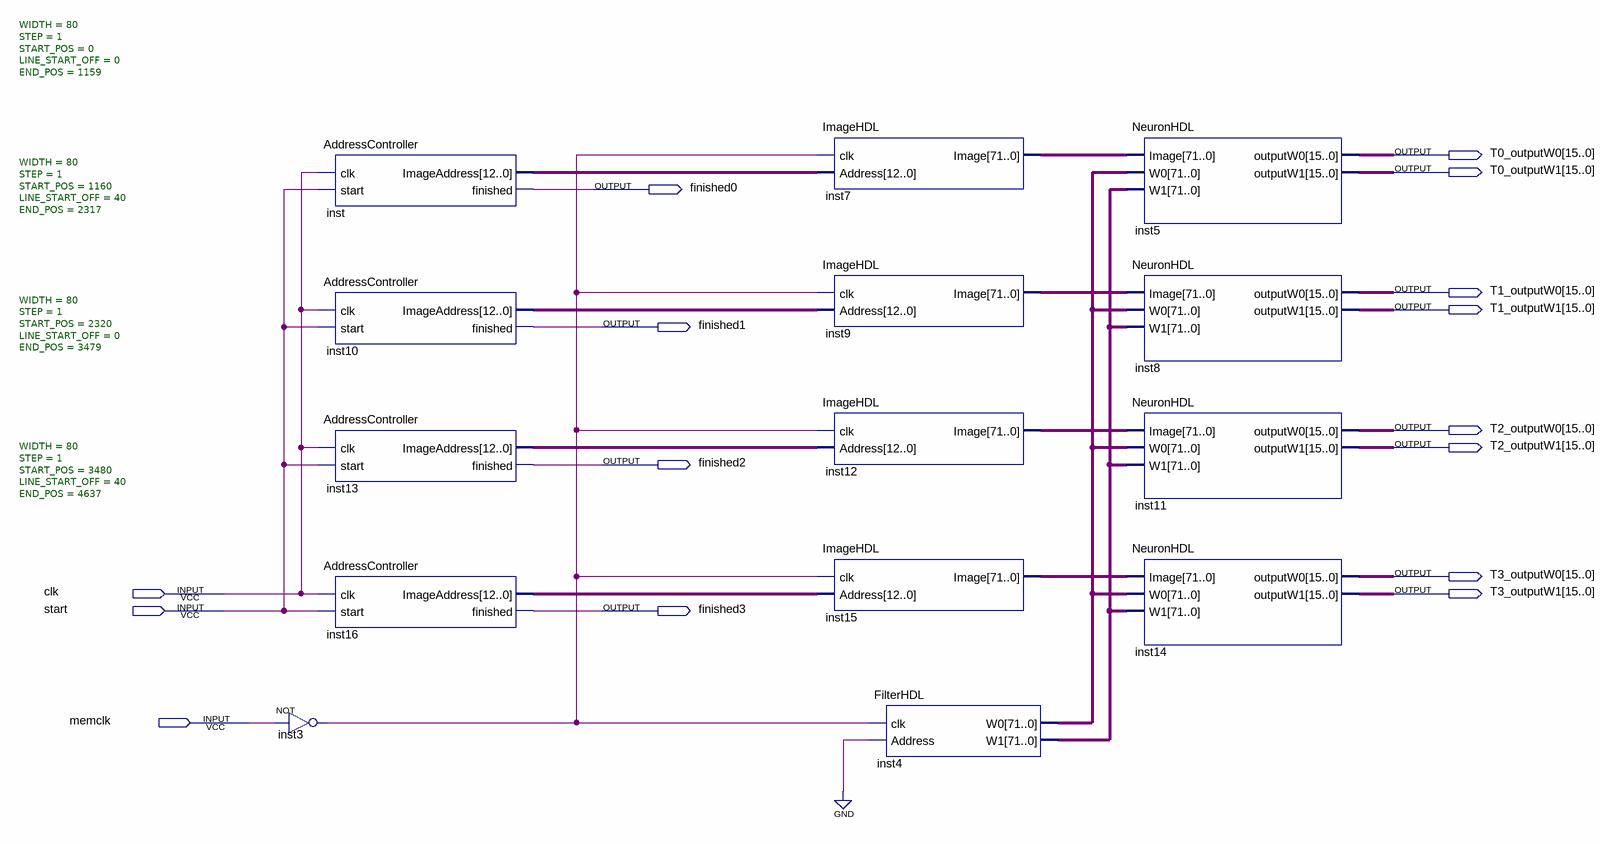
[diagram p0: schematic sheet]
// Quartus schematic CNN_LayerHDL.bdf as structural Verilog: 14 symbols, 15 pins
module CNN_LayerHDL (
  input  clk,
  input  start,
  input  memclk,
  output [15:0] T0_outputW0,
  output [15:0] T0_outputW1,
  output finished0,
  output [15:0] T1_outputW0,
  output [15:0] T1_outputW1,
  output finished1,
  output [15:0] T2_outputW0,
  output [15:0] T2_outputW1,
  output finished2,
  output [15:0] T3_outputW0,
  output [15:0] T3_outputW1,
  output finished3
);

  wire inst3_out;
  wire [12:0] inst10_imageaddress, inst13_imageaddress, inst16_imageaddress, inst_imageaddress;
  wire [71:0] inst4_w0, inst4_w1, inst7_image, inst9_image, inst12_image, inst15_image;

  AddressController #(.WIDTH(80), .STEP(1), .START_POS(0), .LINE_START_OFF(0), .END_POS(1159)) inst (
    .clk(clk), .start(start), .ImageAddress(inst_imageaddress), .finished(finished0));
  AddressController #(.WIDTH(80), .STEP(1), .START_POS(1160), .LINE_START_OFF(40), .END_POS(2317)) inst10 (
    .clk(clk), .start(start), .ImageAddress(inst10_imageaddress), .finished(finished1));
  AddressController #(.WIDTH(80), .STEP(1), .START_POS(2320), .LINE_START_OFF(0), .END_POS(3479)) inst13 (
    .clk(clk), .start(start), .ImageAddress(inst13_imageaddress), .finished(finished2));
  AddressController #(.WIDTH(80), .STEP(1), .START_POS(3480), .LINE_START_OFF(40), .END_POS(4637)) inst16 (
    .clk(clk), .start(start), .ImageAddress(inst16_imageaddress), .finished(finished3));
  not inst3 (inst3_out, memclk);
  ImageHDL inst7 (.clk(inst3_out), .Address(inst_imageaddress), .Image(inst7_image));
  ImageHDL inst9 (.clk(inst3_out), .Address(inst10_imageaddress), .Image(inst9_image));
  ImageHDL inst12 (.clk(inst3_out), .Address(inst13_imageaddress), .Image(inst12_image));
  ImageHDL inst15 (.clk(inst3_out), .Address(inst16_imageaddress), .Image(inst15_image));
  FilterHDL inst4 (.clk(inst3_out), .Address(1'b0), .W0(inst4_w0), .W1(inst4_w1));
  NeuronHDL inst5 (.Image(inst7_image), .W0(inst4_w0), .W1(inst4_w1), .outputW0(T0_outputW0), .outputW1(T0_outputW1));
  NeuronHDL inst8 (.Image(inst9_image), .W0(inst4_w0), .W1(inst4_w1), .outputW0(T1_outputW0), .outputW1(T1_outputW1));
  NeuronHDL inst11 (.Image(inst12_image), .W0(inst4_w0), .W1(inst4_w1), .outputW0(T2_outputW0), .outputW1(T2_outputW1));
  NeuronHDL inst14 (.Image(inst15_image), .W0(inst4_w0), .W1(inst4_w1), .outputW0(T3_outputW0), .outputW1(T3_outputW1));
endmodule
